# Altium project get it_V4.2.PrjPCB
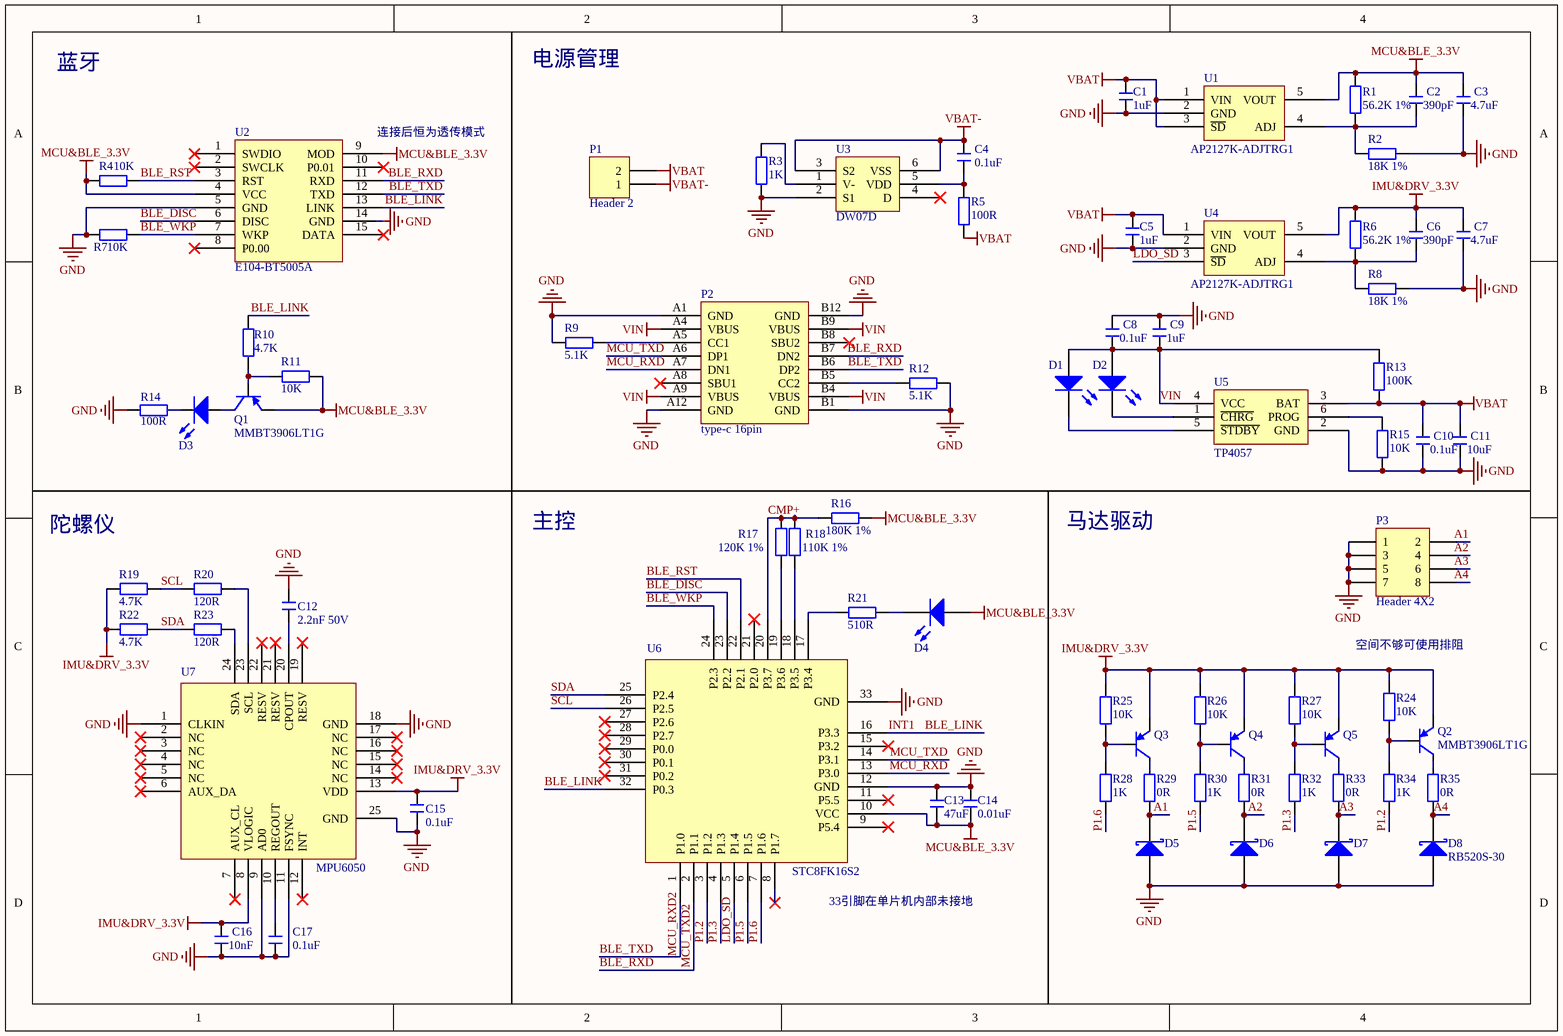
[diagram p0: get it_V4.2.SchDoc]
1 sheet, 75 parts. Net scope: global (net labels, ports and power ports of the same name join across sheets).
Board file: get it_V4.2.PcbDoc

## Sheet get it_V4.2.SchDoc
size A4

### Parts
C1  1uF  [C 0402_L]
C2  390pF  [C 0402_L]
C3  4.7uF  [C 0402_L]
C4  0.1uF  [C 0402_L]
C5  1uF  [C 0402_L]
C6  390pF  [C 0402_L]
C7  4.7uF  [C 0402_L]
C8  0.1uF  [C 0402_L]
C9  1uF  [C 0402_L]
C10  0.1uF  [C 0402_L]
C11  10uF  [C 0402_L]
C12  2.2nF 50V  [C 0402_L]
C13  47uF  [C 0603_L]
C14  0.01uF  [C 0402_L]
C15  0.1uF  [C 0402_L]
C16  10nF  [C 0402_L]
C17  0.1uF  [C 0402_L]
D1  LED  [LED_0603]  (value not drawn)
D2  LED  [LED_0603]  (value not drawn)
D3  LED  [LED_0603]  (value not drawn)
D4  LED  [LED_0603]  (value not drawn)
D5  (no value)  [SOD-523]
D6  (no value)  [SOD-523]
D7  (no value)  [SOD-523]
D8  RB520S-30  [SOD-523]
P1  Header 2  [BAT_header]
P2  type-c 16pin  [type-c 16pin 沉板母座]
P3  Header 4X2  [MOTOR_HEADER]
Q1  MMBT3906LT1G  [SOT23-3L]
Q2  MMBT3906LT1G  [SOT23-3L]
Q3  (no value)  [SOT23-3L]
Q4  (no value)  [SOT23-3L]
Q5  (no value)  [SOT23-3L]
R1  56.2K 1%  [R 0402_L]
R2  18K 1%  [R 0402_L]
R3  1K  [R 0402_L]
R4  10K  [R 0402_L]
R5  100R  [R 0402_L]
R6  56.2K 1%  [R 0402_L]
R7  10K  [R 0402_L]
R8  18K 1%  [R 0402_L]
R9  5.1K  [R 0402_L]
R10  value 4.7K  [R 0402_L]  (hidden comment: Res)
R11  10K  [R 0402_L]
R12  5.1K  [R 0402_L]
R13  100K  [R 0402_L]
R14  value 100R  [R 0402_L]  (hidden comment: Res)
R15  10K  [R 0402_L]
R16  180K 1%  [R 0402_L]
R17  120K 1%  [R 0402_L]
R18  110K 1%  [R 0402_L]
R19  4.7K  [R 0402_L]
R20  120R  [R 0402_L]
R21  510R  [R 0402_L]
R22  4.7K  [R 0402_L]
R23  120R  [R 0402_L]
R24  10K  [R 0402_L]
R25  10K  [R 0402_L]
R26  10K  [R 0402_L]
R27  10K  [R 0402_L]
R28  1K  [R 0402_L]
R29  0R  [R 0402_L]
R30  1K  [R 0402_L]
R31  0R  [R 0402_L]
R32  1K  [R 0402_L]
R33  0R  [R 0402_L]
R34  1K  [R 0402_L]
R35  0R  [R 0402_L]
U1  AP2127K-ADJTRG1  [SOT-23-5]
U2  E104-BT5005A  [E104-BT5005A]
U3  DW07D  [SOT-23-6]
U4  AP2127K-ADJTRG1  [SOT-23-5]
U5  TP4057  [SOT-23-6]
U6  STC8FK16S2  [QFN40P400X400X75_HS-33N]
U7  MPU6050  [QFN50P400X400X90_HS-25N]

### Nets
GND: C1.1 C3.1 C5.1 C7.1 C8.2 C9.2 C10.1 C11.1 C12.2 C13.2 C14.2 C15.1 C16.1 C17.1 D5.1(A) D6.1(A) D7.1(A) D8.1(A) P2.A1(GND) P2.A12(GND) P2.B1(GND) P2.B12(GND) P3.1 P3.3 P3.5 P3.7 R2.1 R3.1 R7.2 R8.1 R9.1 R12.2 R14.2 R15.1 U1.2(GND) U2.5(GND) U2.14(GND) U3.2(S1) U4.2(GND) U5.2(GND) U6.12(GND) U6.33(GND) U7.1(CLKIN) U7.9(AD0) U7.11(FSYNC) U7.18(GND) U7.25(GND)
IMU&DRV_3.3V: C6.2 C7.2 C15.2 C16.2 Q2.2(E) Q3.2(E) Q4.2(E) Q5.2(E) R6.2 R19.1 R22.1 R24.2 R25.2 R26.2 R27.2 U4.5(VOUT) U7.8(VLOGIC) U7.13(VDD)
MCU&BLE_3.3V: C2.2 C3.2 C13.1 C14.1 D4.1(A) Q1.2(E) R1.2 R4.2 R11.1 R16.1 U1.5(VOUT) U2.4(VCC) U2.9(MOD) U6.10(VCC)
VBAT: C1.2 C5.2 C10.2 C11.2 P1.2 R5.1 R13.1 U1.1(VIN) U1.3(~{SD}) U4.1(VIN) U5.3(BAT)
VBAT-: C4.2 P1.1 U3.3(S2) U3.6(VSS)
VIN: C8.1 C9.1 D1.1(A) D2.1(A) P2.A4(VBUS) P2.A9(VBUS) P2.B4(VBUS) P2.B9(VBUS) R13.2 U5.4(VCC)
A1: D5.2(K) P3.2 R29.1
A2: D6.2(K) P3.4 R31.1
A3: D7.2(K) P3.6 R33.1
A4: D8.2(K) P3.8 R35.1
BLE_DISC: U2.6(DISC) U6.23(P2.2)
BLE_LINK: R10.2 U2.13(LINK) U6.16(P3.3) U6.32(P0.3)  [also labelled INT1]
BLE_RST: R4.1 U2.3(RST) U6.22(P2.1)
BLE_RXD: P2.B7(DN2) U2.11(RXD) U6.2(P1.1)  [also labelled MCU_TXD2]
BLE_TXD: P2.B6(DP2) U2.12(TXD) U6.1(P1.0)  [also labelled MCU_RXD2]
BLE_WKP: R7.1 U2.7(WKP) U6.24(P2.3)
CMP+: R16.2 R17.1 R18.1 U6.20(P3.7)
LDO_SD: U4.3(~{SD}) U6.5(P1.4)
MCU_RXD: P2.A7(DN1) U6.13(P3.0)
MCU_TXD: P2.A6(DP1) U6.14(P3.1)
P1.2: R34.1 U6.3(P1.2)
P1.3: R32.1 U6.4(P1.3)
P1.5: R30.1 U6.6(P1.5)
P1.6: R28.1 U6.7(P1.6)
SCL: R19.2 R20.1 U6.26(P2.5)
SDA: R22.2 R23.1 U6.25(P2.4)
NetC2_1: C2.1 R1.1 R2.2 U1.4(ADJ)
NetC4_1: C4.1 R5.2 U3.5(VDD)
NetC6_1: C6.1 R6.1 R8.2 U4.4(ADJ)
NetC12_1: C12.1 U7.20(CPOUT)
NetC17_2: C17.2 U7.10(REGOUT)
NetD1_2: D1.2(K) U5.5(~{STDBY})
NetD2_2: D2.2(K) U5.1(~{CHRG})
NetD3_1: D3.1(A) Q1.3(C)
NetD3_2: D3.2(K) R14.1
NetD4_2: D4.2(K) R21.1
NetP2_A5: P2.A5(CC1) R9.2
NetP2_B5: P2.B5(CC2) R12.1
NetQ1_1: Q1.1(B) R10.1 R11.2
NetQ2_1: Q2.1(B) R24.1 R34.2
NetQ2_3: Q2.3(C) R35.2
NetQ3_1: Q3.1(B) R25.1 R28.2
NetQ3_3: Q3.3(C) R29.2
NetQ4_1: Q4.1(B) R26.1 R30.2
NetQ4_3: Q4.3(C) R31.2
NetQ5_1: Q5.1(B) R27.1 R32.2
NetQ5_3: Q5.3(C) R33.2
NetR3_2: R3.2 U3.1(V-)
NetR15_2: R15.2 U5.6(PROG)
NetR17_2: R17.2 U6.19(P3.6)
NetR18_2: R18.2 U6.18(P3.5)
NetR20_2: R20.2 U7.23(SCL)
NetR21_2: R21.2 U6.17(P3.4)
NetR23_2: R23.2 U7.24(SDA)

Not connected (* = marked no-connect by the designer): P2 A8(SBU1)* B8(SBU2)*; U2 1(SWDIO)* 2(SWCLK)* 8(P0.00)* 10(P0.01)* 15(DATA)*; U3 4(D)*; U6 8(P1.7)* 9(P5.4)* 11(P5.5)* 15(P3.2)* 21(P2.0)* 27(P2.6)* 28(P2.7)* 29(P0.0)* 30(P0.1)* 31(P0.2)*; U7 2(NC)* 3(NC)* 4(NC)* 5(NC)* 6(AUX_DA)* 7(AUX_CL)* 12(INT)* 14(NC)* 15(NC)* 16(NC)* 17(NC)* 19(RESV)* 21(RESV)* 22(RESV)*

### Notes on the sheet
- 蓝牙
- 电源管理
- (near U2) 连接后恒为透传模式
- 陀螺仪
- 主控
- 马达驱动
- 空间不够可使用排阻
- (near U6) 33引脚在单片机内部未接地

### Library data of the parts
C1-C17 = C: 贴片电容; BOM名称: 无极性贴片电容; 淘宝ID: 封装库来自淘宝 ID：黄晶宝石; 联系售后，技术支持: https://shop463601444.taobao.com; 唯一出售店铺网址: https://shop463601444.taobao.com
D1 D2 D4 = LED: 发光二极管; 技术支持，联系售后: https://shop463601444.taobao.com
D3 = LED: LED GREEN; Published: 8-Jun-2000; LatestRevisionDate: 08-Jul-2005; LatestRevisionNote: Mech Layer 1 removed.; PackageReference: LED-0; Publisher: Altium Limited
D5 D6 D8 = SS14: 肖特基二极管; 属性: 40V/1A; BOM名称: 肖特基二极管; 封装库来自淘宝 ID：黄晶宝石: https://shop463601444.taobao.com
D7 = SS210: 肖特基二极管; BOM名称: 肖特基二极管; 学习资源: https://shop463601444.taobao.com
P1 = Header 2: Header, 2-Pin; LatestRevisionDate: 17-Jul-2002; LatestRevisionNote: Re-released for DXP Platform.; Publisher: Altium Limited
P2 = type-c 16pin 沉板母座
P3 = Header 4X2: Header, 4-Pin, Dual row; LatestRevisionDate: 17-Jul-2002; LatestRevisionNote: Re-released for DXP Platform.; Publisher: Altium Limited
Q1-Q5 = 9012-SMD: 低频放大-PNP型; 版权归属: 封装库来自淘宝 ID：黄晶宝石; 属性: 50V 0.5A 0.625W; BOM名称: 低频放大-PNP型; 学习资源: https://shop463601444.taobao.com
R1-R9 R11-R13 R15-R35 = R: 贴片电阻; 版权归属: 来自淘宝 ID：黄晶宝石; 封装库来自淘宝卖家 ID：黄晶宝石: 其他店铺购入均为盗版，不享受售后技术支持服务，请立即申请退款; BOM名称: 贴片电阻; 联系售后: https://shop463601444.taobao.com
R10 = Res: 4.7K; Published: 8-Jun-2000; LatestRevisionDate: 17-Jul-2002; LatestRevisionNote: Re-released for DXP Platform.; PackageReference: AXIAL-0.4; Publisher: Altium Limited
R14 = Res: 100R; Published: 8-Jun-2000; LatestRevisionDate: 17-Jul-2002; LatestRevisionNote: Re-released for DXP Platform.; PackageReference: AXIAL-0.4; Publisher: Altium Limited
U3 = DW06D
U6 = STC8FK16S2(QFN32)